# Altium schematic sheet FPGA_Alarm_Clock.SchDoc: LiveDesign Evaluation - Alarm Clock
size A3; Organization: Altium Limited; Address1: L3, 12a Rodborough Rd; Address2: Frenchs Forest; Address3: NSW; Address4: Australia 2086; DocumentNumber: 1; SheetNumber: 1; SheetTotal: 10
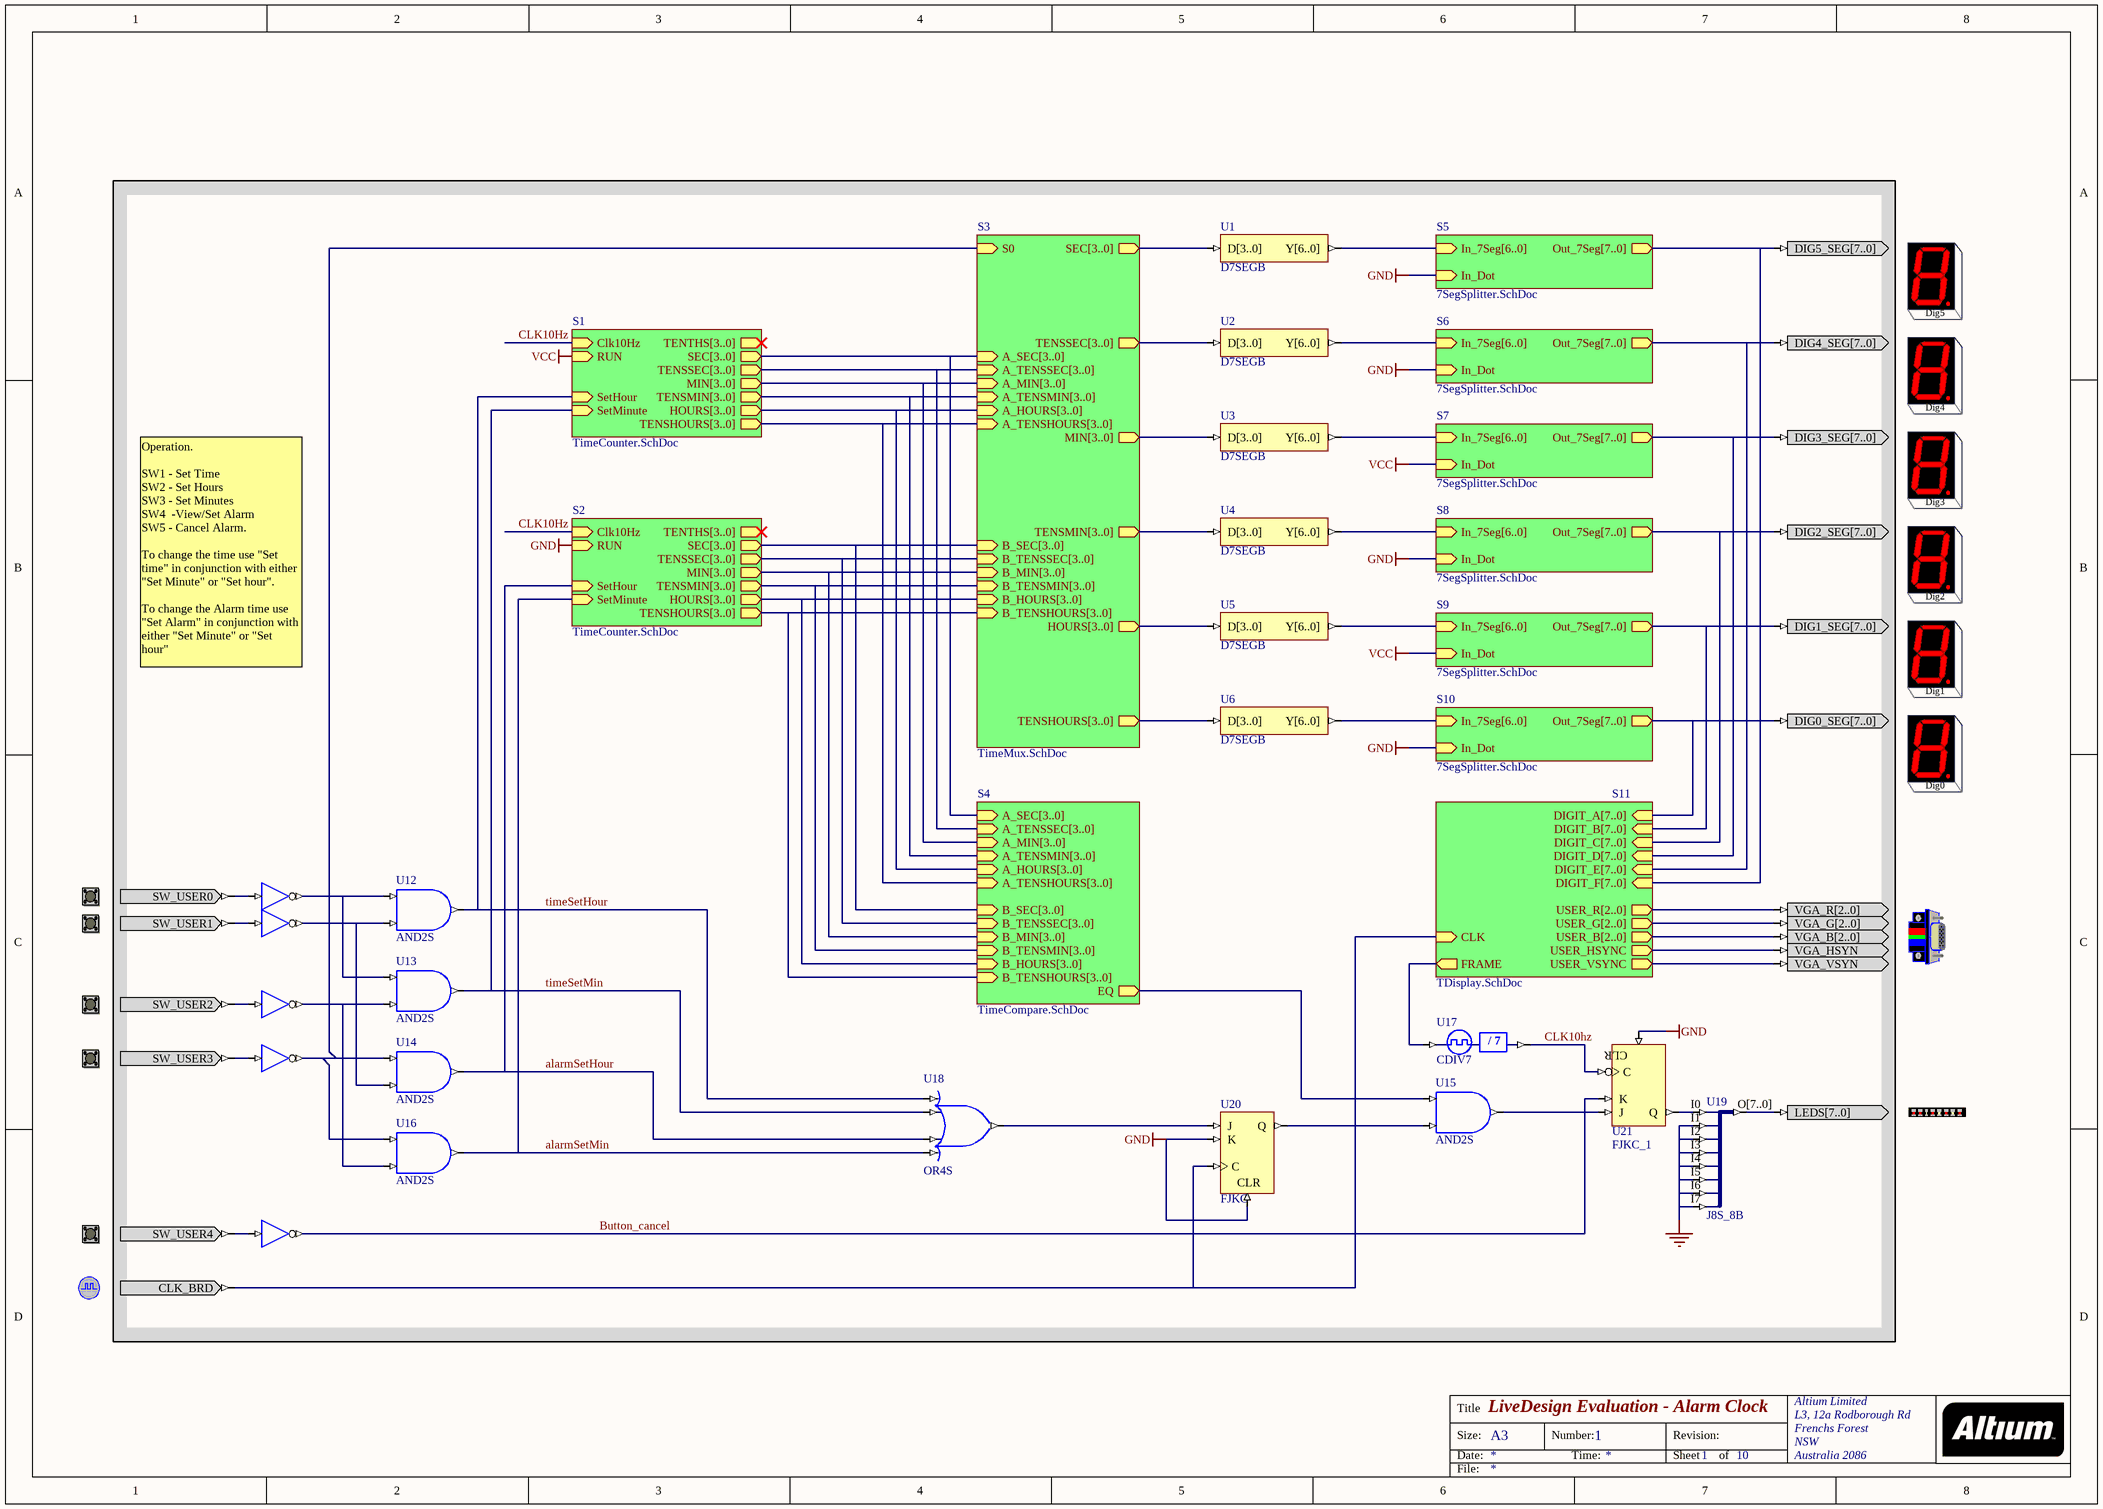
[diagram p0: FPGA_Alarm_Clock.SchDoc]

## Parts
7SEG0  7SEG0  (value not drawn)
7SEG1  7SEG1  (value not drawn)
7SEG2  7SEG2  (value not drawn)
7SEG3  7SEG3  (value not drawn)
7SEG4  7SEG4  (value not drawn)
7SEG5  7SEG5  (value not drawn)
CLOCK_BOARD  CLOCK_BOARD  (value not drawn)
LED  LED  (value not drawn)
U1  D7SEGB
U2  D7SEGB
U3  D7SEGB
U4  D7SEGB
U5  D7SEGB
U6  D7SEGB
U7  INV  (value not drawn)
U8  INV  (value not drawn)
U9  INV  (value not drawn)
U10  INV  (value not drawn)
U11  INV  (value not drawn)
U12  AND2S
U13  AND2S
U14  AND2S
U15  AND2S
U16  AND2S
U17  CDIV7
U18  OR4S
U19  J8S_8B
U20  FJKC
U21  FJKC_1
USER_BUTTON0  USER_BUTTON0  (value not drawn)
USER_BUTTON1  USER_BUTTON1  (value not drawn)
USER_BUTTON2  USER_BUTTON2  (value not drawn)
USER_BUTTON3  USER_BUTTON3  (value not drawn)
USER_BUTTON4  USER_BUTTON4  (value not drawn)
VGACNTR  VGACNTR  (value not drawn)

## Sub-sheets
S1 = TimeCounter.SchDoc: SetHour (in), SetMinute (in), Clk10Hz (in), SEC[3..0] (out), TENSSEC[3..0] (out), MIN[3..0] (out), TENSMIN[3..0] (out), HOURS[3..0] (out), TENSHOURS[3..0] (out), RUN (in), TENTHS[3..0] (out)
S2 = TimeCounter.SchDoc: SetHour (in), SetMinute (in), Clk10Hz (in), SEC[3..0] (out), TENSSEC[3..0] (out), MIN[3..0] (out), TENSMIN[3..0] (out), HOURS[3..0] (out), TENSHOURS[3..0] (out), RUN (in), TENTHS[3..0] (out)
S3 = TimeMux.SchDoc: SEC[3..0] (out), TENSSEC[3..0] (out), MIN[3..0] (out), TENSMIN[3..0] (out), HOURS[3..0] (out), TENSHOURS[3..0] (out), A_SEC[3..0] (in), A_TENSSEC[3..0] (in), A_MIN[3..0] (in), A_TENSMIN[3..0] (in), A_HOURS[3..0] (in), A_TENSHOURS[3..0] (in), B_SEC[3..0] (in), B_TENSSEC[3..0] (in), B_MIN[3..0] (in), B_TENSMIN[3..0] (in), B_HOURS[3..0] (in), B_TENSHOURS[3..0] (in), S0 (in)
S4 = TimeCompare.SchDoc: A_MIN[3..0] (in), A_TENSMIN[3..0] (in), A_HOURS[3..0] (in), A_TENSHOURS[3..0] (in), B_MIN[3..0] (in), B_TENSMIN[3..0] (in), B_HOURS[3..0] (in), B_TENSHOURS[3..0] (in), A_SEC[3..0] (in), A_TENSSEC[3..0] (in), B_SEC[3..0] (in), B_TENSSEC[3..0] (in), EQ (out)
S5 = 7SegSplitter.SchDoc: In_7Seg[6..0] (in), In_Dot (in), Out_7Seg[7..0] (out)
S6 = 7SegSplitter.SchDoc: In_7Seg[6..0] (in), In_Dot (in), Out_7Seg[7..0] (out)
S7 = 7SegSplitter.SchDoc: In_7Seg[6..0] (in), In_Dot (in), Out_7Seg[7..0] (out)
S8 = 7SegSplitter.SchDoc: In_7Seg[6..0] (in), In_Dot (in), Out_7Seg[7..0] (out)
S9 = 7SegSplitter.SchDoc: In_7Seg[6..0] (in), In_Dot (in), Out_7Seg[7..0] (out)
S10 = 7SegSplitter.SchDoc: In_7Seg[6..0] (in), In_Dot (in), Out_7Seg[7..0] (out)
S11 = TDisplay.SchDoc: CLK (in), FRAME (out), USER_R[2..0] (out), USER_G[2..0] (out), USER_B[2..0] (out), USER_HSYNC (out), USER_VSYNC (out), DIGIT_A[7..0] (in), DIGIT_B[7..0] (in), DIGIT_C[7..0] (in), DIGIT_D[7..0] (in), DIGIT_E[7..0] (in), DIGIT_F[7..0] (in)

## Nets
GND: U19.I1 U19.I2 U19.I3 U19.I4 U19.I5 U19.I6 U19.I7 U20.CLR U20.K U21.CLR ; sheet S2/RUN, sheet S5/In_Dot, sheet S6/In_Dot, sheet S8/In_Dot, sheet S10/In_Dot
VCC: sheet S1/RUN, sheet S7/In_Dot, sheet S9/In_Dot
alarmSetHour: U14.O U18.I2 ; sheet S2/SetHour
alarmSetMin: U16.O U18.I3 ; sheet S2/SetMinute
Button_cancel: U11.O U21.K
CLK10Hz: U17.CLKDV U21.C ; sheet S1/Clk10Hz, sheet S2/Clk10Hz
timeSetHour: U12.O U18.I0 ; sheet S1/SetHour
timeSetMin: U13.O U18.I1 ; sheet S1/SetMinute
Net7SEG0_DIG0_SEG[7..0]: 7SEG0.DIG0_SEG[7..0] ; sheet S11/DIGIT_A[7..0], sheet S10/Out_7Seg[7..0]
Net7SEG1_DIG1_SEG[7..0]: 7SEG1.DIG1_SEG[7..0] ; sheet S11/DIGIT_B[7..0], sheet S9/Out_7Seg[7..0]
Net7SEG2_DIG2_SEG[7..0]: 7SEG2.DIG2_SEG[7..0] ; sheet S11/DIGIT_C[7..0], sheet S8/Out_7Seg[7..0]
Net7SEG3_DIG3_SEG[7..0]: 7SEG3.DIG3_SEG[7..0] ; sheet S11/DIGIT_D[7..0], sheet S7/Out_7Seg[7..0]
Net7SEG4_DIG4_SEG[7..0]: 7SEG4.DIG4_SEG[7..0] ; sheet S11/DIGIT_E[7..0], sheet S6/Out_7Seg[7..0]
Net7SEG5_DIG5_SEG[7..0]: 7SEG5.DIG5_SEG[7..0] ; sheet S11/DIGIT_F[7..0], sheet S5/Out_7Seg[7..0]
NetCLOCK_BOARD_CLK_BRD: CLOCK_BOARD.CLK_BRD U20.C ; sheet S11/CLK
NetLED_LEDS[7..0]: LED.LEDS[7..0] U19.O[7..0]
NetU1_D[3..0]: U1.D[3..0] ; sheet S3/SEC[3..0]
NetU1_Y[6..0]: U1.Y[6..0] ; sheet S5/In_7Seg[6..0]
NetU2_D[3..0]: U2.D[3..0] ; sheet S3/TENSSEC[3..0]
NetU2_Y[6..0]: U2.Y[6..0] ; sheet S6/In_7Seg[6..0]
NetU3_D[3..0]: U3.D[3..0] ; sheet S3/MIN[3..0]
NetU3_Y[6..0]: U3.Y[6..0] ; sheet S7/In_7Seg[6..0]
NetU4_D[3..0]: U4.D[3..0] ; sheet S3/TENSMIN[3..0]
NetU4_Y[6..0]: U4.Y[6..0] ; sheet S8/In_7Seg[6..0]
NetU5_D[3..0]: U5.D[3..0] ; sheet S3/HOURS[3..0]
NetU5_Y[6..0]: U5.Y[6..0] ; sheet S9/In_7Seg[6..0]
NetU6_D[3..0]: U6.D[3..0] ; sheet S3/TENSHOURS[3..0]
NetU6_Y[6..0]: U6.Y[6..0] ; sheet S10/In_7Seg[6..0]
NetU7_I: U7.I USER_BUTTON0.SW_USER0
NetU7_O: U7.O U12.I0 U13.I0
NetU8_I: U8.I USER_BUTTON1.SW_USER1
NetU8_O: U8.O U12.I1 U14.I1
NetU9_I: U9.I USER_BUTTON2.SW_USER2
NetU9_O: U9.O U13.I1 U16.I1
NetU10_I: U10.I USER_BUTTON3.SW_USER3
NetU10_O: U10.O U14.I0 U16.I0 ; sheet S3/S0
NetU11_I: U11.I USER_BUTTON4.SW_USER4
NetU15_I0: U15.I0 ; sheet S4/EQ
NetU15_I1: U15.I1 U20.Q
NetU15_O: U15.O U21.J
NetU17_CLKIN: U17.CLKIN ; sheet S11/FRAME
NetU18_O: U18.O U20.J
NetU19_I0: U19.I0 U21.Q
NetVGACNTR_VGA_B[2..0]: VGACNTR.VGA_B[2..0] ; sheet S11/USER_B[2..0]
NetVGACNTR_VGA_G[2..0]: VGACNTR.VGA_G[2..0] ; sheet S11/USER_G[2..0]
NetVGACNTR_VGA_HSYN: VGACNTR.VGA_HSYN ; sheet S11/USER_HSYNC
NetVGACNTR_VGA_R[2..0]: VGACNTR.VGA_R[2..0] ; sheet S11/USER_R[2..0]
NetVGACNTR_VGA_VSYN: VGACNTR.VGA_VSYN ; sheet S11/USER_VSYNC

## Buses and harness runs
bus sheet S1/HOURS[3..0] = sheet S3/A_HOURS[3..0] = sheet S4/A_HOURS[3..0]
bus sheet S1/MIN[3..0] = sheet S3/A_MIN[3..0] = sheet S4/A_MIN[3..0]
bus sheet S1/SEC[3..0] = sheet S3/A_SEC[3..0] = sheet S4/A_SEC[3..0]
bus sheet S1/TENSHOURS[3..0] = sheet S3/A_TENSHOURS[3..0] = sheet S4/A_TENSHOURS[3..0]
bus sheet S1/TENSMIN[3..0] = sheet S3/A_TENSMIN[3..0] = sheet S4/A_TENSMIN[3..0]
bus sheet S1/TENSSEC[3..0] = sheet S3/A_TENSSEC[3..0] = sheet S4/A_TENSSEC[3..0]
bus sheet S2/HOURS[3..0] = sheet S3/B_HOURS[3..0] = sheet S4/B_HOURS[3..0]
bus sheet S2/MIN[3..0] = sheet S3/B_MIN[3..0] = sheet S4/B_MIN[3..0]
bus sheet S2/SEC[3..0] = sheet S3/B_SEC[3..0] = sheet S4/B_SEC[3..0]
bus sheet S2/TENSHOURS[3..0] = sheet S3/B_TENSHOURS[3..0] = sheet S4/B_TENSHOURS[3..0]
bus sheet S2/TENSMIN[3..0] = sheet S3/B_TENSMIN[3..0] = sheet S4/B_TENSMIN[3..0]
bus sheet S2/TENSSEC[3..0] = sheet S3/B_TENSSEC[3..0] = sheet S4/B_TENSSEC[3..0]
bus sheet S5/Out_7Seg[7..0] = sheet S11/DIGIT_F[7..0]
bus sheet S6/Out_7Seg[7..0] = sheet S11/DIGIT_E[7..0]
bus sheet S7/Out_7Seg[7..0] = sheet S11/DIGIT_D[7..0]
bus sheet S8/Out_7Seg[7..0] = sheet S11/DIGIT_C[7..0]
bus sheet S9/Out_7Seg[7..0] = sheet S11/DIGIT_B[7..0]
bus sheet S10/Out_7Seg[7..0] = sheet S11/DIGIT_A[7..0]

## Notes on the sheet
- Operation.
  SW1 - Set Time
  SW2 - Set Hours
  SW3 - Set Minutes
  SW4  -View/Set Alarm
  SW5 - Cancel Alarm.
  To change the time use "Set time" in conjunction with either "Set Minute" or "Set hour".
  To change the Alarm time use "Set Alarm" in conjunction with either "Set Minute" or "Set hour"
- Title
- Size:
- Date:
- A3
- Number:
- Time:
- Revision:
- Sheet
- of
- File:
- (in symbol 7SEG0) Dig0
- (in symbol 7SEG1) Dig1
- (in symbol 7SEG2) Dig2
- (in symbol 7SEG3) Dig3
- (in symbol 7SEG4) Dig4
- (in symbol 7SEG5) Dig5
- (in symbol CDIV7) / 7

## Library data of the parts
7SEG0 = 7SEG0: 7 Segment display module; PortComponent: True; Publisher: Altium Limited; Published: 9-Sept-2004
7SEG1 = 7SEG1: 7 Segment display module; PortComponent: True; Publisher: Altium Limited; Published: 9-Sept-2004
7SEG2 = 7SEG2: 7 Segment display module; PortComponent: True; Publisher: Altium Limited; Published: 9-Sept-2004
7SEG3 = 7SEG3: 7 Segment display module; PortComponent: True; Publisher: Altium Limited; Published: 9-Sept-2004
7SEG4 = 7SEG4: 7 Segment display module; PortComponent: True; Publisher: Altium Limited; Published: 9-Sept-2004
7SEG5 = 7SEG5: 7 Segment display module; PortComponent: True; Publisher: Altium Limited; Published: 9-Sept-2004
CLOCK_BOARD = CLOCK_BOARD: Global System Clock Supply; PortComponent: True; Published: 19-Nov-2003; Publisher: Altium Limited
LED = LED: 8-Way LEDS; PortComponent: True; Published: 19-Nov-2003; Publisher: Altium Limited
U1-U6 = D7SEGB: 7-Segment-Display Decoder for Common-Cathode LED (Active High Output), Bus Version; ArchiveName: GENERIC; VHDLIB_SIM: GENERIC_LIB; Published: 29-Jan-2004; Publisher: Altium Limited; Core Revision: 1.00.00
U7-U11 = INV: Inverter; ArchiveName: GENERIC; VHDLIB_SIM: GENERIC_LIB; Published: 29-Jan-2004; Publisher: Altium Limited; Xilinx Equivalent: INV; Core Revision: 1.00.00
U12-U16 = AND2S: 2-Input AND Gate, Single Pin Version; Xilinx Equivalent: AND2; ArchiveName: GENERIC; VHDLIB_SIM: GENERIC_LIB; Published: 29-Jan-2004; Publisher: Altium Limited; Core Revision: 1.00.00
U17 = CDIV7: Clock Divider by 7; ArchiveName: GENERIC; VHDLIB_SIM: GENERIC_LIB; Published: 29-Jan-2004; Publisher: Altium Limited; Core Revision: 1.00.00
U18 = OR4S: 4-Input OR Gate, Single Pin Version; Xilinx Equivalent: OR4; ArchiveName: GENERIC; VHDLIB_SIM: GENERIC_LIB; Published: 29-Jan-2004; Publisher: Altium Limited; Core Revision: 1.00.00
U19 = J8S_8B: 8 Single pin inputs to single 8-Bit output bus; ArchiveName: GENERIC; VHDLIB_SIM: GENERIC_LIB; Published: 29-Jan-2004; Publisher: Altium Limited; Core Revision: 1.00.00
U20 = FJKC: J-K Flip-Flop with Asynchronous Clear; ArchiveName: GENERIC; VHDLIB_SIM: GENERIC_LIB; Published: 29-Jan-2004; Publisher: Altium Limited; Xilinx Equivalent: FJKC; Core Revision: 1.00.00
U21 = FJKC_1: J-K Negative Edge Flip-Flop with Asynchronous Clear; ArchiveName: GENERIC; VHDLIB_SIM: GENERIC_LIB; Published: 29-Jan-2004; Publisher: Altium Limited; Core Revision: 1.00.00
USER_BUTTON0 = USER_BUTTON0: User Buttons; PortComponent: True; Published: 19-Nov-2003; Publisher: Altium Limited
USER_BUTTON1 = USER_BUTTON1: User Buttons; PortComponent: True; Published: 19-Nov-2003; Publisher: Altium Limited
USER_BUTTON2 = USER_BUTTON2: User Buttons; PortComponent: True; Published: 19-Nov-2003; Publisher: Altium Limited
USER_BUTTON3 = USER_BUTTON3: User Buttons; PortComponent: True; Published: 19-Nov-2003; Publisher: Altium Limited
USER_BUTTON4 = USER_BUTTON4: User Buttons; PortComponent: True; Published: 19-Nov-2003; Publisher: Altium Limited
VGACNTR = VGACNTR: VGA Dsub-15-Female-HD; PortComponent: True; Published: 19-Nov-2003; Publisher: Altium Limited